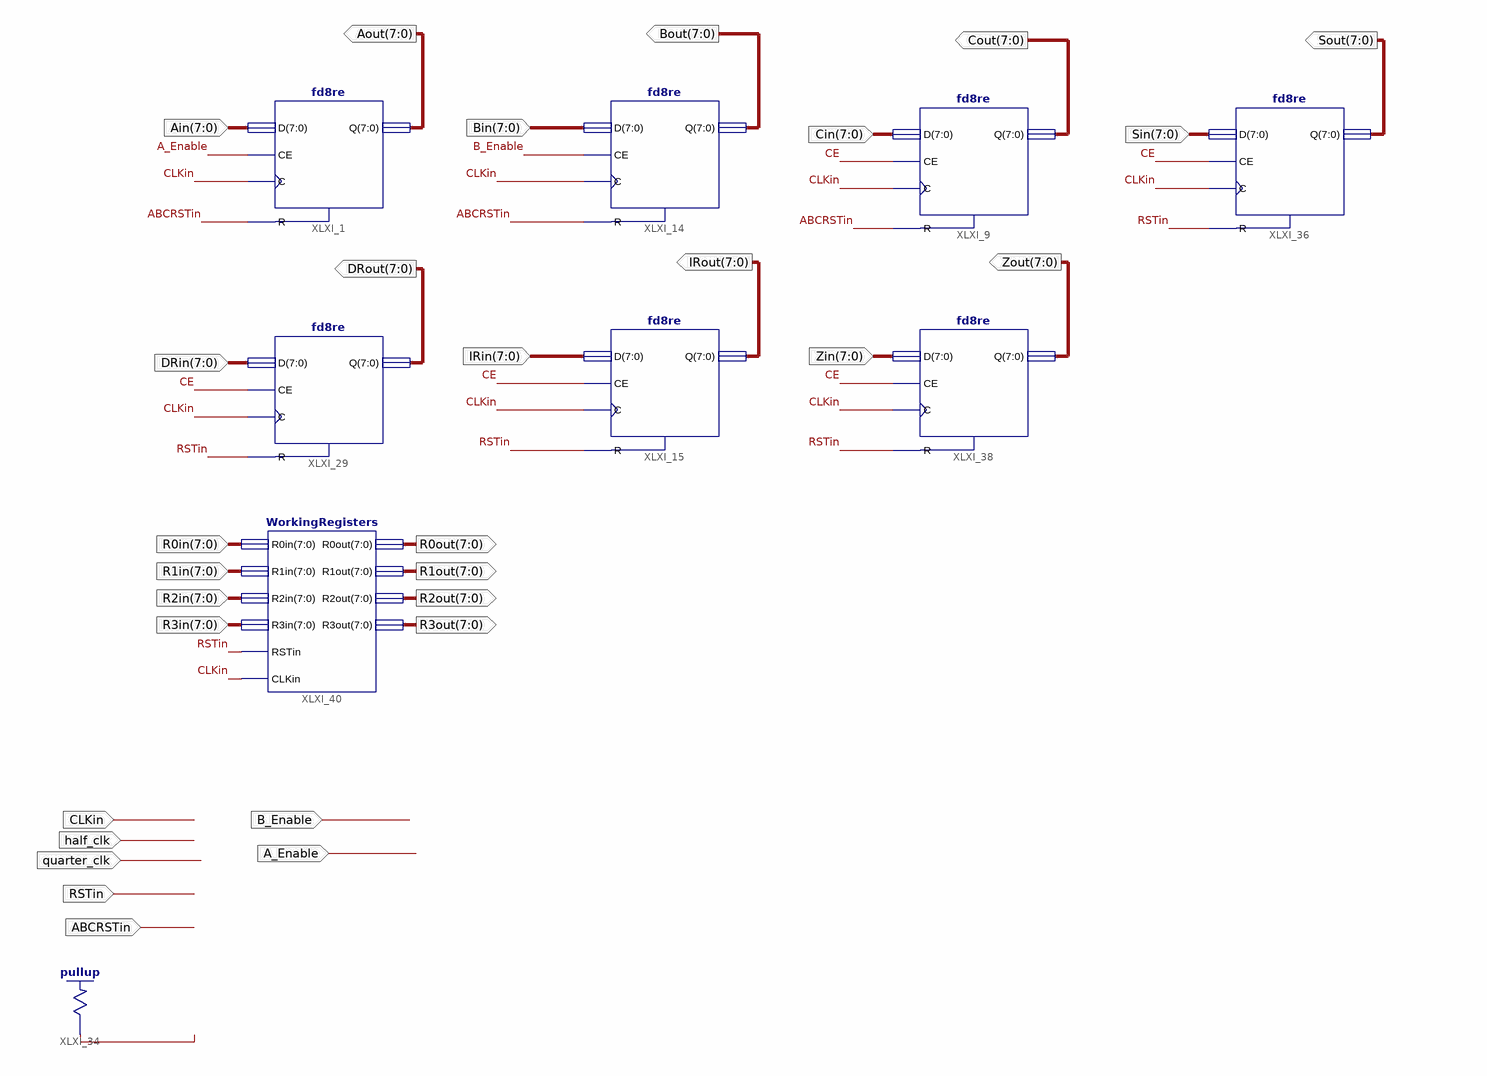
[diagram p0: schematic sheet 1]
// Xilinx ISE schematic RegisterBank.sch (spartan3e) as structural Verilog: 9 symbols, 29 ports
module RegisterBank (
  input  ABCRSTin,
  input  RSTin,
  input  [7:0] DRin,
  input  [7:0] Ain,
  input  [7:0] Bin,
  input  [7:0] IRin,
  input  [7:0] Zin,
  input  [7:0] Cin,
  input  [7:0] Sin,
  input  [7:0] R0in,
  input  [7:0] R1in,
  input  [7:0] R2in,
  input  [7:0] R3in,
  input  quarter_clk,
  input  CLKin,
  input  B_Enable,
  input  A_Enable,
  input  half_clk,
  output [7:0] DRout,
  output [7:0] Aout,
  output [7:0] Bout,
  output [7:0] IRout,
  output [7:0] Zout,
  output [7:0] Cout,
  output [7:0] Sout,
  output [7:0] R0out,
  output [7:0] R1out,
  output [7:0] R2out,
  output [7:0] R3out
);

  wire CE;

  \pullup  XLXI_34 (.O(CE));
  fd8re XLXI_29 (.C(CLKin), .CE(CE), .D(DRin), .R(RSTin), .Q(DRout));
  fd8re XLXI_1 (.C(CLKin), .CE(A_Enable), .D(Ain), .R(ABCRSTin), .Q(Aout));
  fd8re XLXI_14 (.C(CLKin), .CE(B_Enable), .D(Bin), .R(ABCRSTin), .Q(Bout));
  fd8re XLXI_15 (.C(CLKin), .CE(CE), .D(IRin), .R(RSTin), .Q(IRout));
  fd8re XLXI_38 (.C(CLKin), .CE(CE), .D(Zin), .R(RSTin), .Q(Zout));
  fd8re XLXI_9 (.C(CLKin), .CE(CE), .D(Cin), .R(ABCRSTin), .Q(Cout));
  fd8re XLXI_36 (.C(CLKin), .CE(CE), .D(Sin), .R(RSTin), .Q(Sout));
  WorkingRegisters XLXI_40 (
    .R0in(R0in), .R1in(R1in), .R2in(R2in), .R3in(R3in), .R0out(R0out), .R1out(R1out), .R2out(R2out),
    .R3out(R3out), .RSTin(RSTin), .CLKin(CLKin));
endmodule
